# EAGLE schematic Christmas_Star (EAGLE 7.5.0)

## Sheet 1 of 5: 0.8-14V to 5V converter
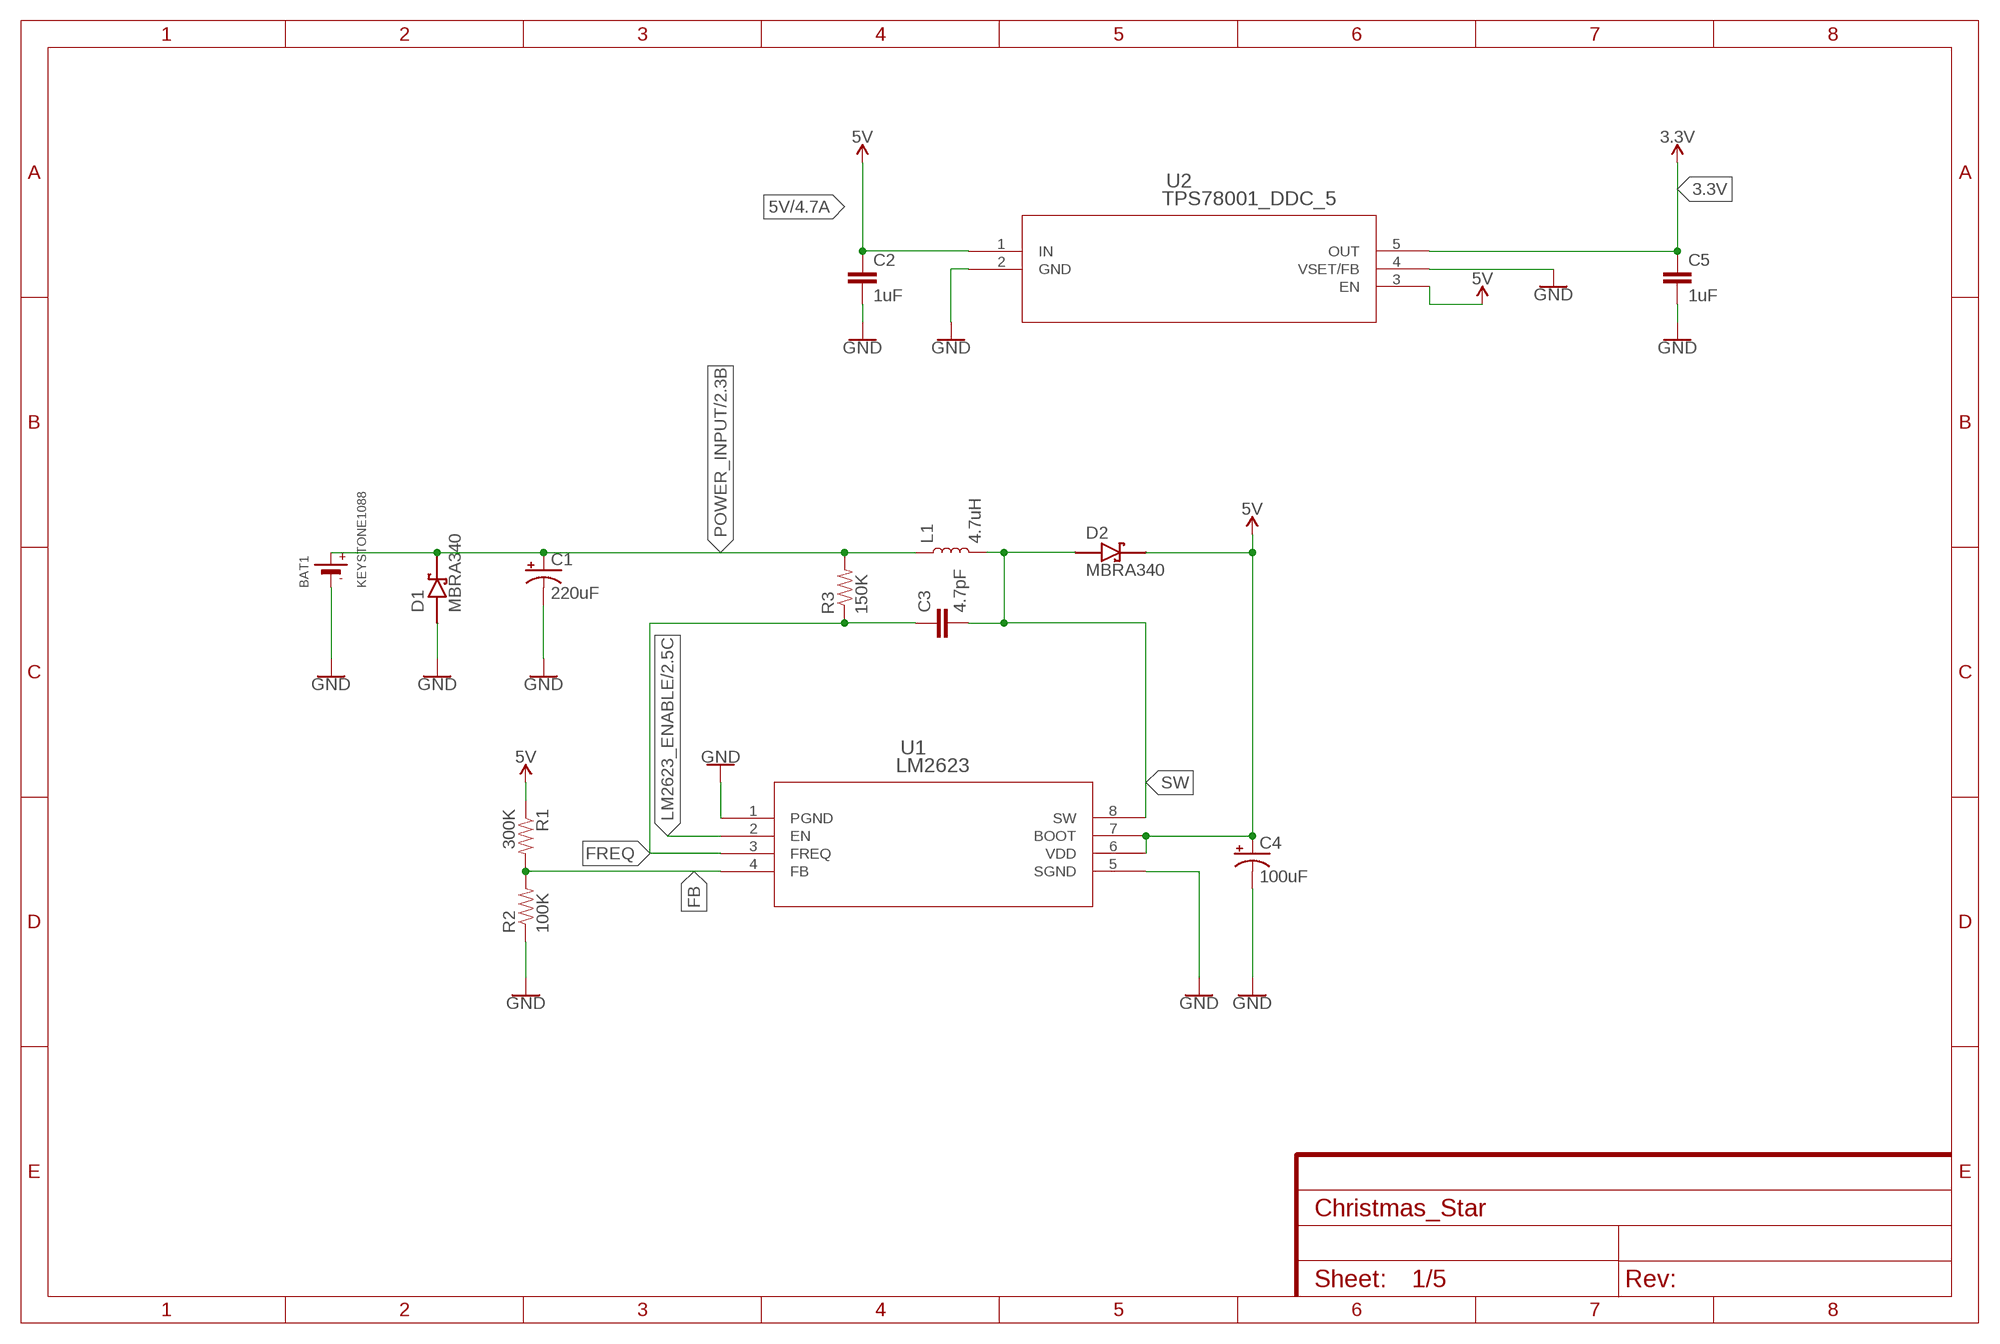
[diagram p0: schematic, sheet 1]
FRAME1 (FRAME-A4L): CNAME: Boost converter (5V), LDO (3.3V); CREVISION: 0.2; DESIGNER: NA'

### Parts
BAT1  KEYSTONE1088  [KEYSTONE1088]
C1  220uF  CAP_POL3528-KIT  [EIA3528-KIT]
C2  1uF  CAP0603-CAP  [0603-CAP]
C3  4.7pF  CAP0603-CAP  [0603-CAP]
C4  100uF  CAP_POL1206-KIT  [EIA3216-KIT]
C5  1uF  CAP0603-CAP  [0603-CAP]
D1  MBRA340  SS12  [DIOM4427X270N]
D2  MBRA340  SS12  [DIOM4427X270N]
L1  4.7uH  INDUCTOR  [LTF5022]
R1  300K  RESISTOR0603-RES  [0603-RES]
R2  100K  RESISTOR0603-RES  [0603-RES]
R3  150K  RESISTOR0603-RES  [0603-RES]
U1  LM2623  LM2623_DGK_8  [MUA08A]
U2  TPS78001_DDC_5  [DDC5]

### Nets
3.3V [3.3V]: C5.1 U2.5(OUT) ; also sheet 5
5V [5V]: C2.1 C4.A(+) D2.C R1.1 U1.6(VDD) U1.7(BOOT) U2.1(IN) U2.3(EN) ; also sheet 3,4,5
FB: R1.2 R2.2 U1.4(FB)
FREQ: C3.1 R3.1 U1.3(FREQ)
GND [GND]: BAT1.- C1.C(-) C2.2 C4.C(-) C5.2 D1.A R2.1 U1.1(PGND) U1.5(SGND) U2.2(GND) U2.4(VSET/FB) ; also sheet 2,3,4,5
LM2623_ENABLE: U1.2(EN) ; also sheet 2
POWER_INPUT [POWER_INPUT]: BAT1.+ C1.A(+) D1.C L1.P$1 R3.2 ; also sheet 2
SW [SW]: C3.2 D2.A L1.P$2 U1.8(SW)

## Sheet 2 of 5: LM2623 Enable Control
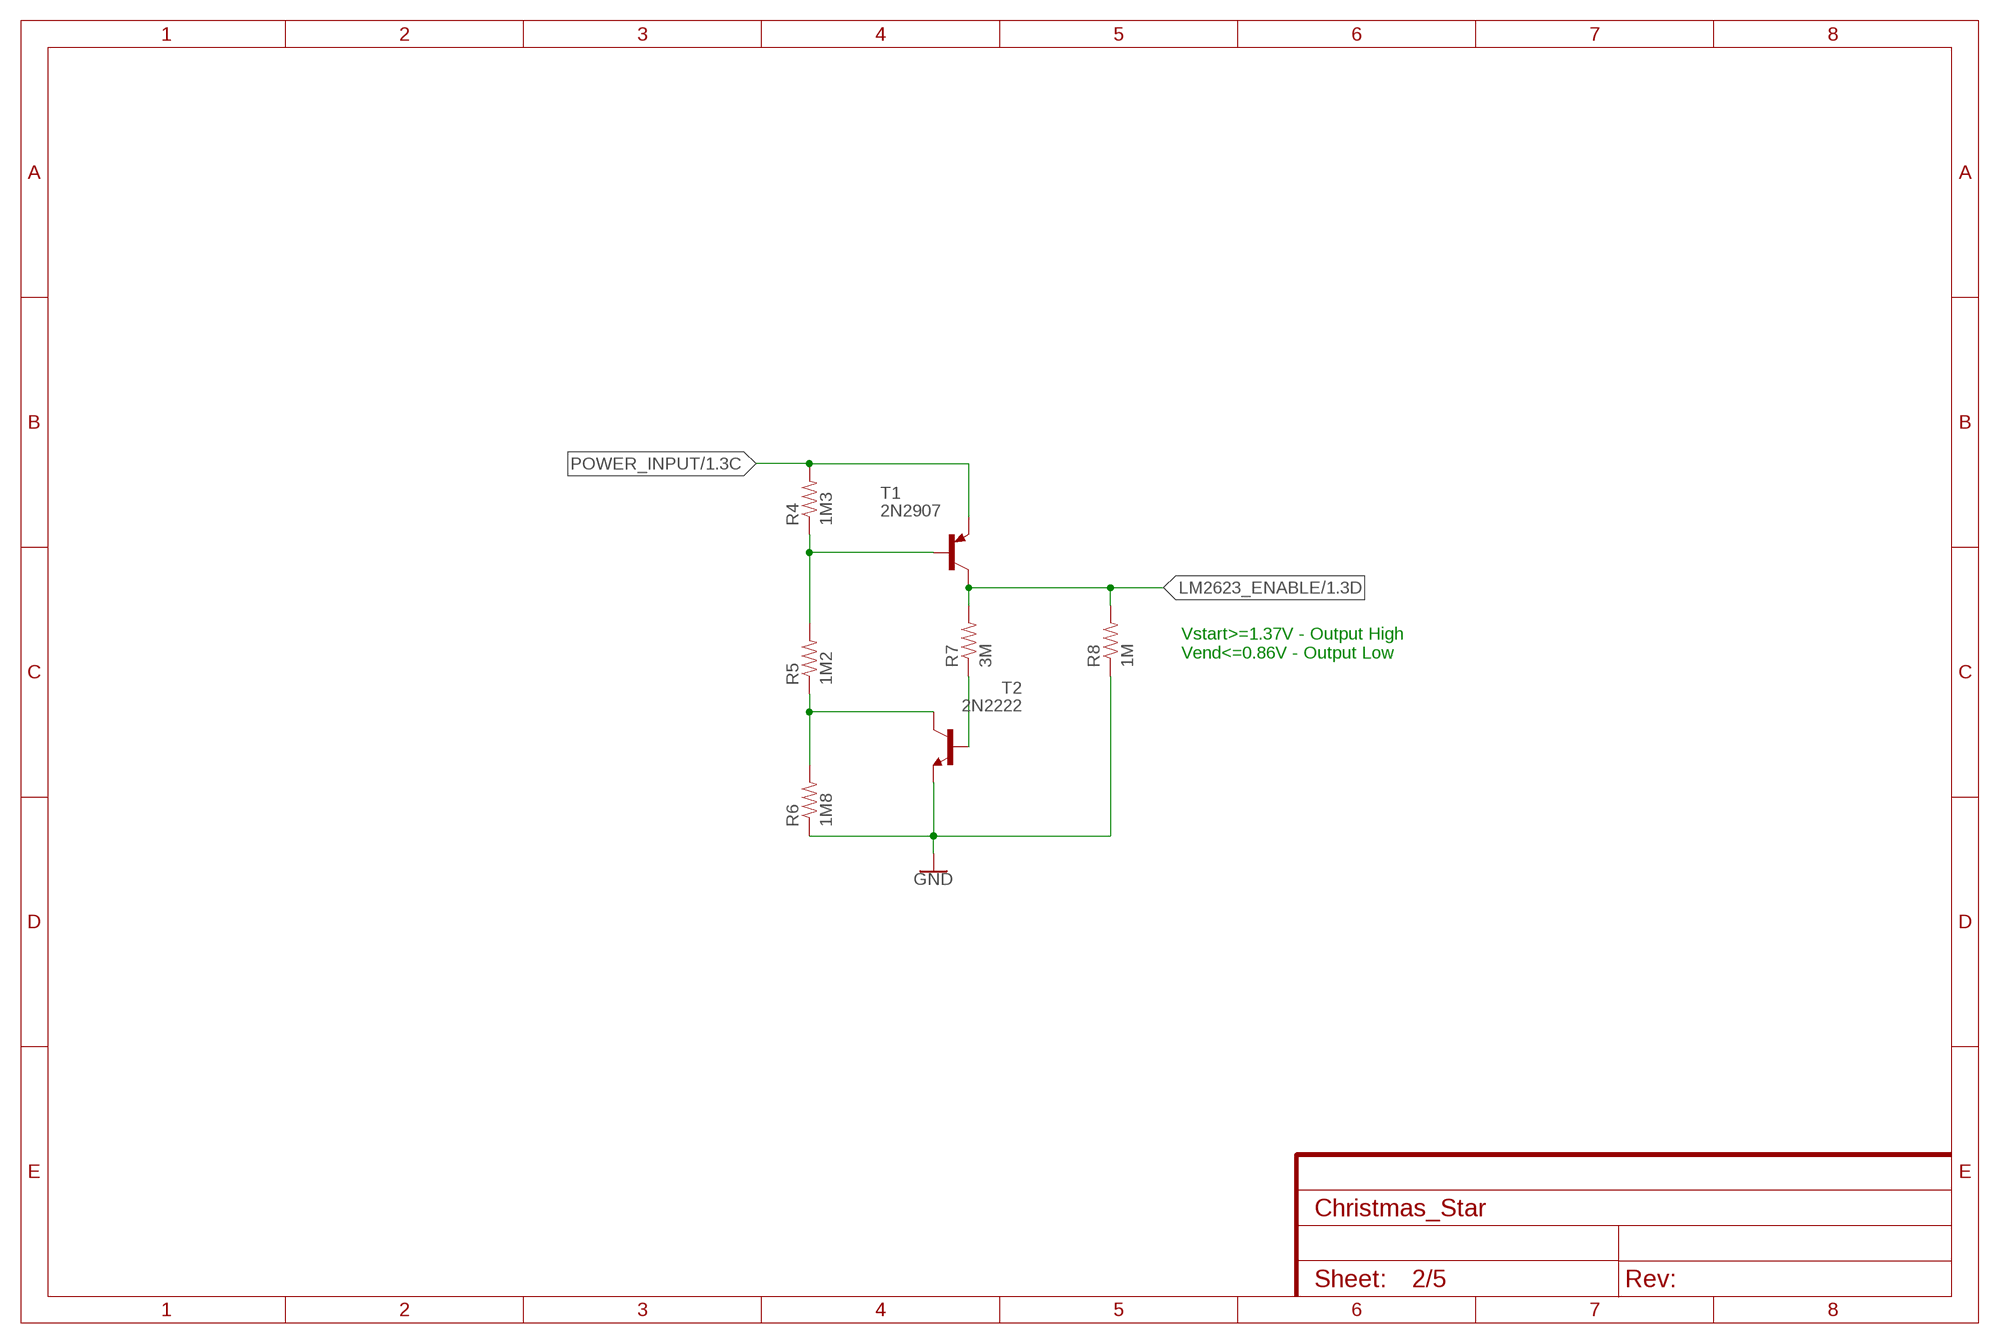
[diagram p1: schematic, sheet 2]
FRAME2 (FRAME-A4L): CNAME: LM2623 EN Pin Control; CREVISION: 0.3; DESIGNER: NA'

### Parts
R4  1M3  RESISTOR0603-RES  [0603-RES]
R5  1M2  RESISTOR0603-RES  [0603-RES]
R6  1M8  RESISTOR0603-RES  [0603-RES]
R7  3M  RESISTOR0603-RES  [0603-RES]
R8  1M  RESISTOR0603-RES  [0603-RES]
T1  2N2907  MMBT2907ALT1-PNP-SOT23-BEC  [SOT23-BEC]
T2  2N2222  MMBT2222ALT1-NPN-SOT23-BEC  [SOT23-BEC]

### Nets
GND [GND]: R6.1 R8.1 T2.E ; also sheet 1,3,4,5
LM2623_ENABLE: R7.2 R8.2 T1.C ; also sheet 1
N$36: R4.1 R5.2 T1.B
N$37: R5.1 R6.2 T2.C
N$43: R7.1 T2.B
POWER_INPUT [POWER_INPUT]: R4.2 T1.E ; also sheet 1

### Notes on the sheet
- Vstart>=1.37V - Output High
  Vend<=0.86V - Output Low

## Sheet 3 of 5: APA102-5050 RGB LED Chain
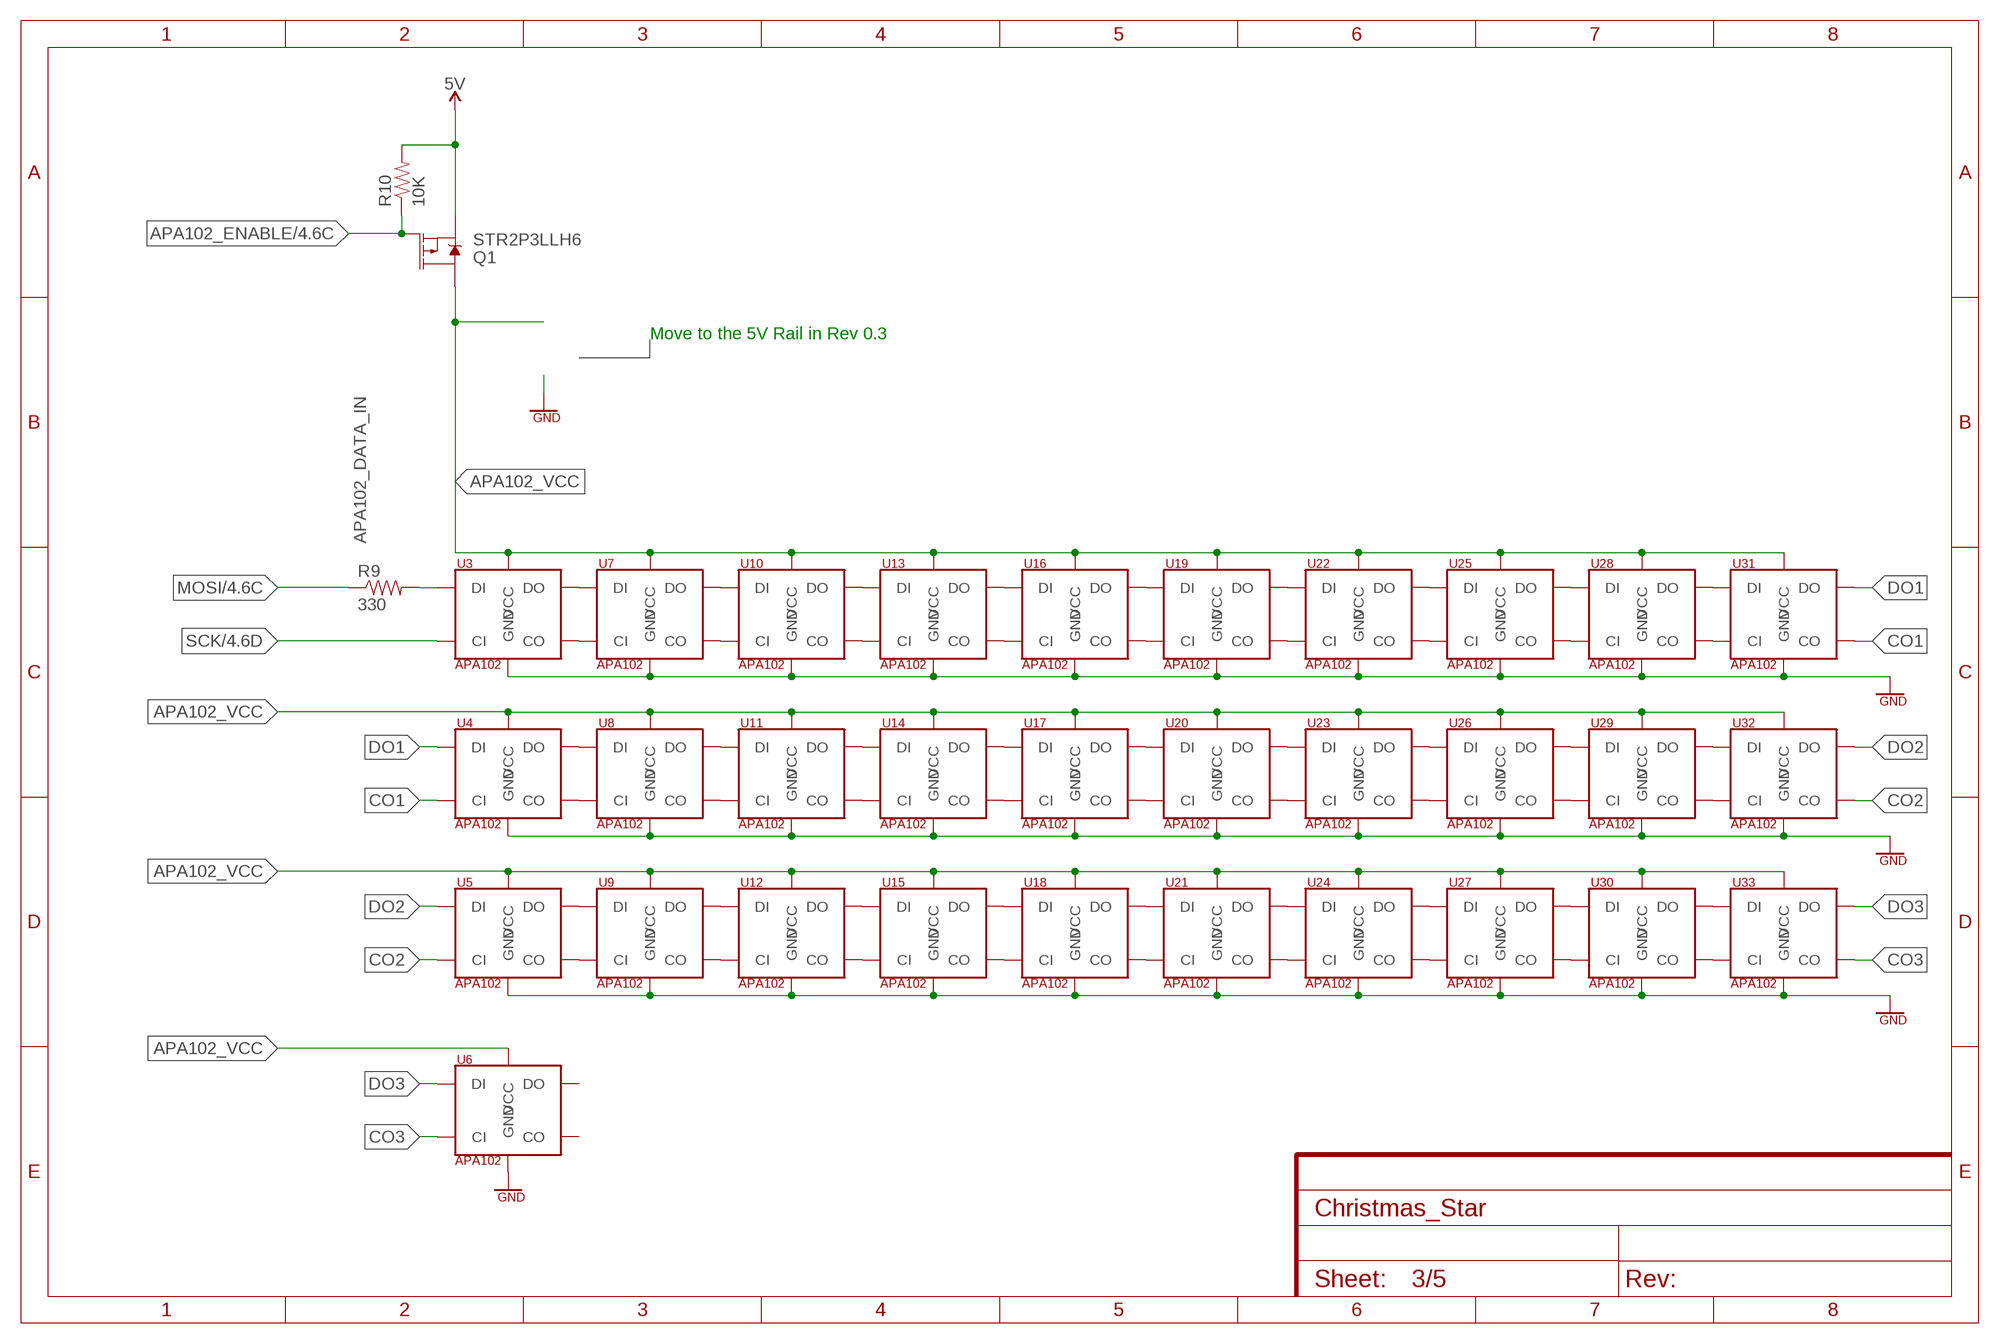
[diagram p2: schematic, sheet 3]
FRAME3 (FRAME-A4L): CNAME: APA102C RGB LEDs; CREVISION: 0.2; DESIGNER: NA'

### Parts
Q1  STR2P3LLH6  MOSFET_PCH-IRLML2244  [SOT23-3]
R9  330  RESISTOR0603-RES  [0603-RES]
R10  10K  RESISTOR0603-RES  [0603-RES]
U3  APA102  APA1022020  [APA102_2020]
U4  APA102  APA1022020  [APA102_2020]
U5  APA102  APA1022020  [APA102_2020]
U6  APA102  APA1022020  [APA102_2020]
U7  APA102  APA1022020  [APA102_2020]
U8  APA102  APA1022020  [APA102_2020]
U9  APA102  APA1022020  [APA102_2020]
U10  APA102  APA1022020  [APA102_2020]
U11  APA102  APA1022020  [APA102_2020]
U12  APA102  APA1022020  [APA102_2020]
U13  APA102  APA1022020  [APA102_2020]
U14  APA102  APA1022020  [APA102_2020]
U15  APA102  APA1022020  [APA102_2020]
U16  APA102  APA1022020  [APA102_2020]
U17  APA102  APA1022020  [APA102_2020]
U18  APA102  APA1022020  [APA102_2020]
U19  APA102  APA1022020  [APA102_2020]
U20  APA102  APA1022020  [APA102_2020]
U21  APA102  APA1022020  [APA102_2020]
U22  APA102  APA1022020  [APA102_2020]
U23  APA102  APA1022020  [APA102_2020]
U24  APA102  APA1022020  [APA102_2020]
U25  APA102  APA1022020  [APA102_2020]
U26  APA102  APA1022020  [APA102_2020]
U27  APA102  APA1022020  [APA102_2020]
U28  APA102  APA1022020  [APA102_2020]
U29  APA102  APA1022020  [APA102_2020]
U30  APA102  APA1022020  [APA102_2020]
U31  APA102  APA1022020  [APA102_2020]
U32  APA102  APA1022020  [APA102_2020]
U33  APA102  APA1022020  [APA102_2020]

### Nets
5V [5V]: Q1.2(S) R10.2 ; also sheet 1,4,5
APA102_DATA_IN: R9.2 U3.D_IN(DI)
APA102_ENABLE: Q1.1(G) R10.1 ; also sheet 4
APA102_VCC [APA102_VCC]: Q1.3(D) U3.VCC U4.VCC U5.VCC U6.VCC U7.VCC U8.VCC U9.VCC U10.VCC U11.VCC U12.VCC U13.VCC U14.VCC U15.VCC U16.VCC U17.VCC U18.VCC U19.VCC U20.VCC U21.VCC U22.VCC U23.VCC U24.VCC U25.VCC U26.VCC U27.VCC U28.VCC U29.VCC U30.VCC U31.VCC U32.VCC U33.VCC
CO1: U4.C_IN(CI) U31.CL_OUT(CO)
CO2: U5.C_IN(CI) U32.CL_OUT(CO)
CO3: U6.C_IN(CI) U33.CL_OUT(CO)
DO1: U4.D_IN(DI) U31.D_OUT(DO)
DO2: U5.D_IN(DI) U32.D_OUT(DO)
DO3: U6.D_IN(DI) U33.D_OUT(DO)
GND [GND]: U3.GND U4.GND U5.GND U6.GND U7.GND U8.GND U9.GND U10.GND U11.GND U12.GND U13.GND U14.GND U15.GND U16.GND U17.GND U18.GND U19.GND U20.GND U21.GND U22.GND U23.GND U24.GND U25.GND U26.GND U27.GND U28.GND U29.GND U30.GND U31.GND U32.GND U33.GND ; also sheet 1,2,4,5
MOSI: R9.1 ; also sheet 4
N$1: U3.D_OUT(DO) U7.D_IN(DI)
N$2: U3.CL_OUT(CO) U7.C_IN(CI)
N$3: U7.D_OUT(DO) U10.D_IN(DI)
N$4: U7.CL_OUT(CO) U10.C_IN(CI)
N$5: U10.D_OUT(DO) U13.D_IN(DI)
N$6: U10.CL_OUT(CO) U13.C_IN(CI)
N$7: U13.D_OUT(DO) U16.D_IN(DI)
N$8: U13.CL_OUT(CO) U16.C_IN(CI)
N$9: U16.D_OUT(DO) U19.D_IN(DI)
N$10: U16.CL_OUT(CO) U19.C_IN(CI)
N$11: U19.D_OUT(DO) U22.D_IN(DI)
N$12: U19.CL_OUT(CO) U22.C_IN(CI)
N$13: U22.D_OUT(DO) U25.D_IN(DI)
N$14: U22.CL_OUT(CO) U25.C_IN(CI)
N$15: U25.D_OUT(DO) U28.D_IN(DI)
N$16: U25.CL_OUT(CO) U28.C_IN(CI)
N$17: U28.D_OUT(DO) U31.D_IN(DI)
N$18: U28.CL_OUT(CO) U31.C_IN(CI)
N$19: U4.D_OUT(DO) U8.D_IN(DI)
N$20: U4.CL_OUT(CO) U8.C_IN(CI)
N$21: U8.D_OUT(DO) U11.D_IN(DI)
N$22: U8.CL_OUT(CO) U11.C_IN(CI)
N$23: U11.D_OUT(DO) U14.D_IN(DI)
N$24: U11.CL_OUT(CO) U14.C_IN(CI)
N$25: U14.D_OUT(DO) U17.D_IN(DI)
N$26: U14.CL_OUT(CO) U17.C_IN(CI)
N$27: U17.D_OUT(DO) U20.D_IN(DI)
N$28: U17.CL_OUT(CO) U20.C_IN(CI)
N$29: U20.D_OUT(DO) U23.D_IN(DI)
N$30: U20.CL_OUT(CO) U23.C_IN(CI)
N$31: U23.D_OUT(DO) U26.D_IN(DI)
N$32: U23.CL_OUT(CO) U26.C_IN(CI)
N$33: U26.D_OUT(DO) U29.D_IN(DI)
N$34: U26.CL_OUT(CO) U29.C_IN(CI)
N$35: U29.D_OUT(DO) U32.D_IN(DI)
N$40: U29.CL_OUT(CO) U32.C_IN(CI)
N$41: U5.D_OUT(DO) U9.D_IN(DI)
N$44: U5.CL_OUT(CO) U9.C_IN(CI)
N$45: U9.D_OUT(DO) U12.D_IN(DI)
N$46: U9.CL_OUT(CO) U12.C_IN(CI)
N$48: U12.D_OUT(DO) U15.D_IN(DI)
N$49: U12.CL_OUT(CO) U15.C_IN(CI)
N$50: U15.D_OUT(DO) U18.D_IN(DI)
N$51: U15.CL_OUT(CO) U18.C_IN(CI)
N$52: U18.D_OUT(DO) U21.D_IN(DI)
N$53: U18.CL_OUT(CO) U21.C_IN(CI)
N$55: U21.D_OUT(DO) U24.D_IN(DI)
N$56: U21.CL_OUT(CO) U24.C_IN(CI)
N$58: U24.D_OUT(DO) U27.D_IN(DI)
N$60: U24.CL_OUT(CO) U27.C_IN(CI)
N$61: U27.D_OUT(DO) U30.D_IN(DI)
N$62: U27.CL_OUT(CO) U30.C_IN(CI)
N$63: U30.D_OUT(DO) U33.D_IN(DI)
N$64: U30.CL_OUT(CO) U33.C_IN(CI)
SCK: U3.C_IN(CI) ; also sheet 4
Unconnected: U6.CL_OUT(CO) U6.D_OUT(DO)

### Notes on the sheet
- Move to the 5V Rail in Rev 0.3

## Sheet 4 of 5: ATMEGA328P-U
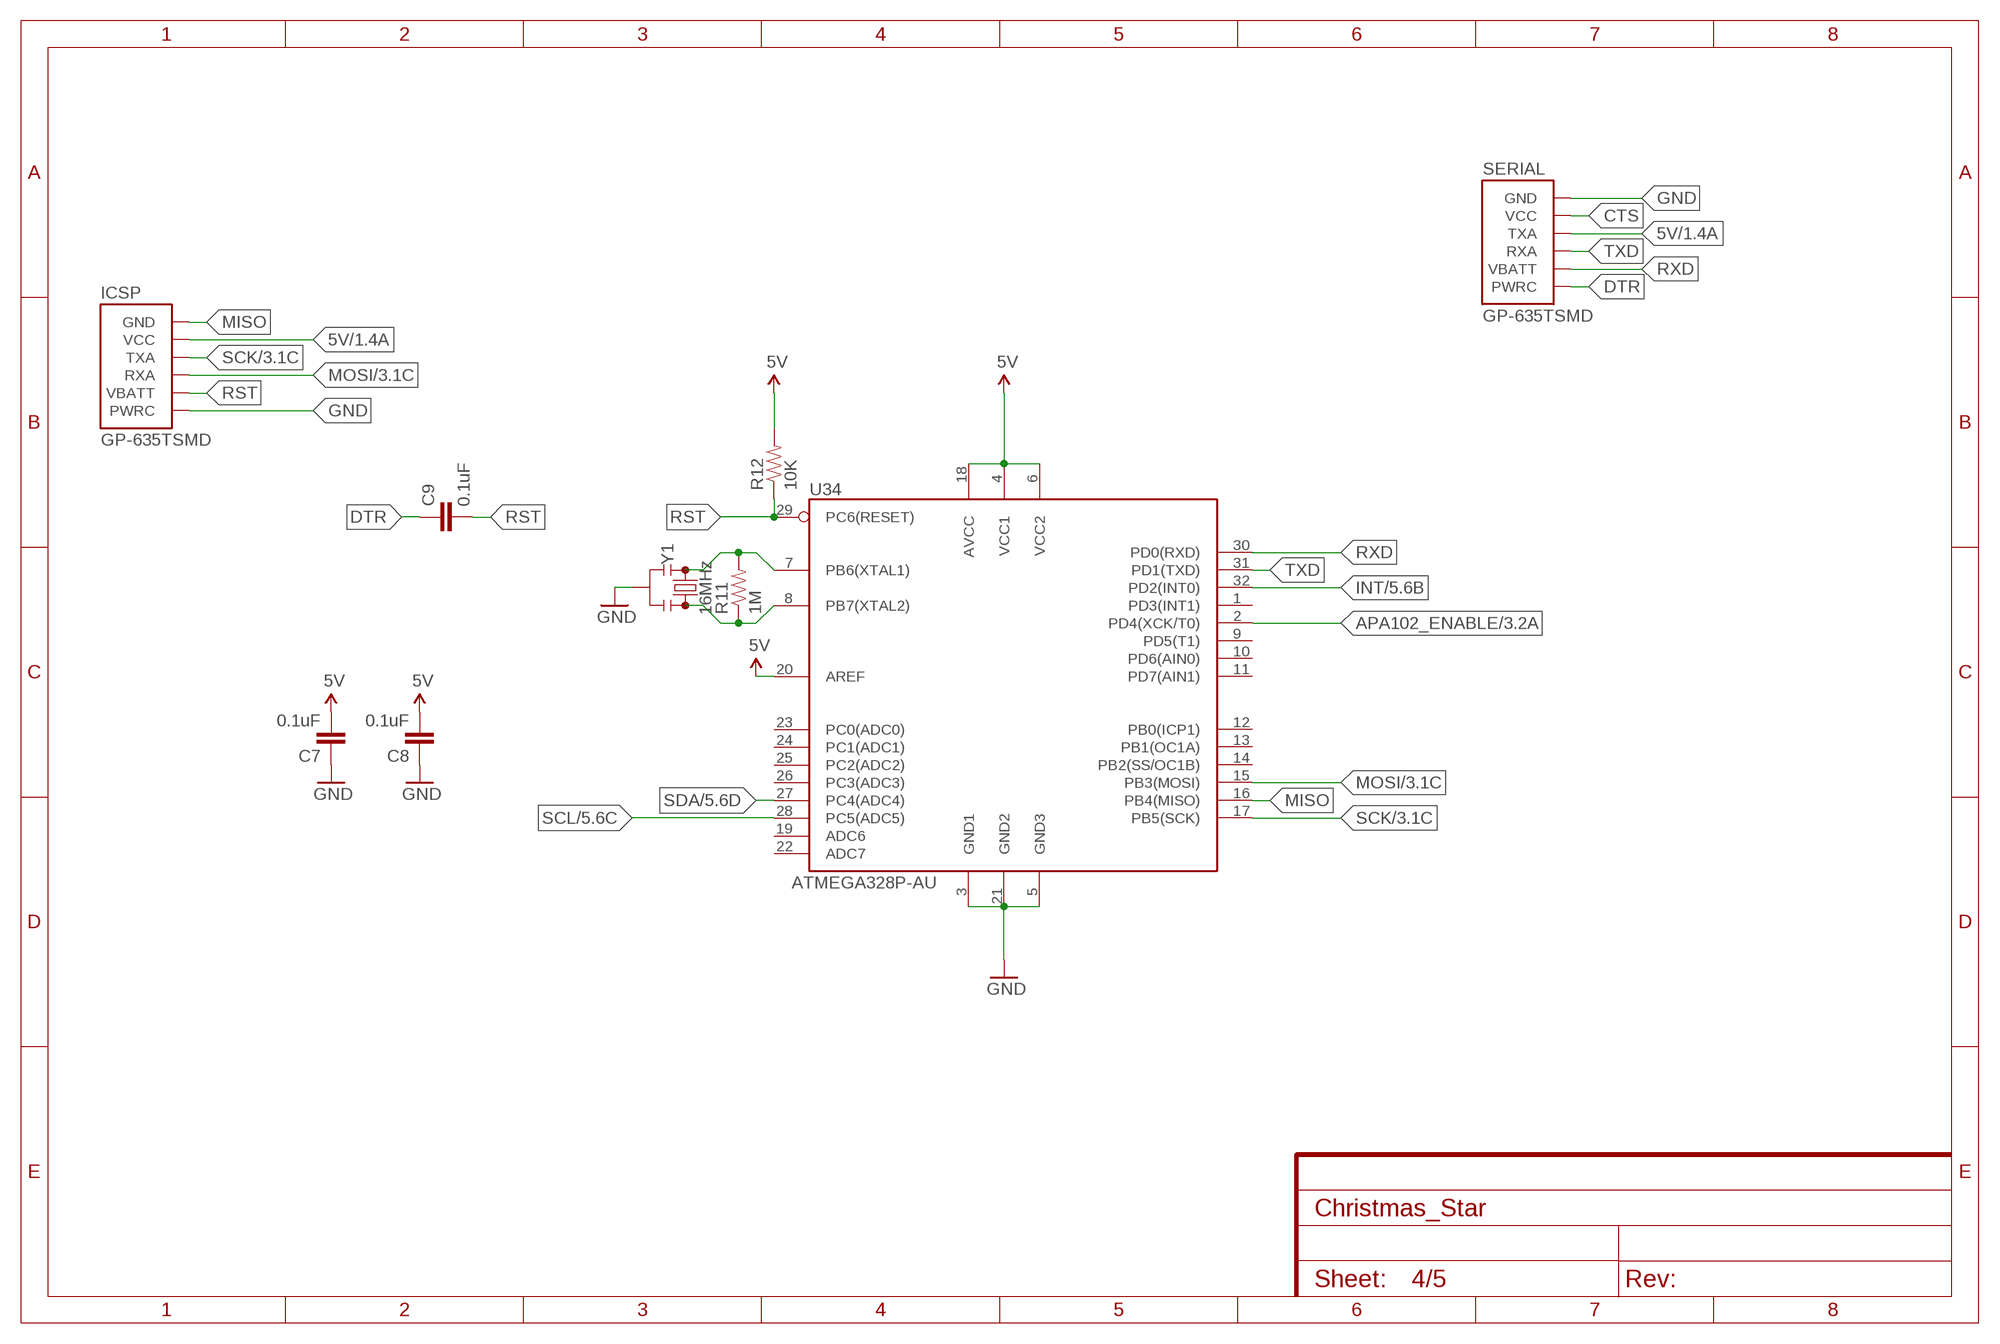
[diagram p3: schematic, sheet 4]
FRAME4 (FRAME-A4L): CNAME: ATMEGA328P-U; CREVISION: 0.2; DESIGNER: NA'

### Parts
C7  0.1uF  CAP0603-CAP  [0603-CAP]
C8  0.1uF  CAP0603-CAP  [0603-CAP]
C9  0.1uF  CAP0603-CAP  [0603-CAP]
ICSP  GP-635TSMD  [GP-635T]
R11  1M  RESISTOR0603-RES  [0603-RES]
R12  10K  RESISTOR0603-RES  [0603-RES]
SERIAL  GP-635TSMD  [GP-635T]
U34  ATMEGA328P-AU  [TQFP32]
Y1  16MHz  RESONATOR-16MHZSMD_3.2X1.3  [RESONATOR-SMD-3.2X1.3]

### Nets
5V [5V]: C7.2 C8.2 ICSP.2(VCC) R12.2 SERIAL.3(TXA) U34.4(VCC1) U34.6(VCC2) U34.18(AVCC) U34.20(AREF) ; also sheet 1,3,5
APA102_ENABLE: U34.2(PD4(XCK/T0)) ; also sheet 3
CTS: SERIAL.2(VCC)
DTR: C9.1 SERIAL.6(PWRC)
GND [GND]: C7.1 C8.1 ICSP.6(PWRC) SERIAL.1(GND) U34.3(GND1) U34.5(GND3) U34.21(GND2) Y1.2 ; also sheet 1,2,3,5
INT: U34.32(PD2(INT0)) ; also sheet 5
MISO: ICSP.1(GND) U34.16(PB4(MISO))
MOSI: ICSP.4(RXA) U34.15(PB3(MOSI)) ; also sheet 3
N$38: R11.2 U34.7(PB6(XTAL1)) Y1.1
N$39: R11.1 U34.8(PB7(XTAL2)) Y1.3
RST: C9.2 ICSP.5(VBATT) R12.1 U34.29(PC6(RESET))
RXD: SERIAL.5(VBATT) U34.30(PD0(RXD))
SCK: ICSP.3(TXA) U34.17(PB5(SCK)) ; also sheet 3
SCL: U34.28(PC5(ADC5)) ; also sheet 5
SDA: U34.27(PC4(ADC4)) ; also sheet 5
TXD: SERIAL.4(RXA) U34.31(PD1(TXD))
Unconnected: U34.1(PD3(INT1)) U34.9(PD5(T1)) U34.10(PD6(AIN0)) U34.11(PD7(AIN1)) U34.12(PB0(ICP1)) U34.13(PB1(OC1A)) U34.14(PB2(SS/OC1B)) U34.19(ADC6) U34.22(ADC7) U34.23(PC0(ADC0)) U34.24(PC1(ADC1)) U34.25(PC2(ADC2)) U34.26(PC3(ADC3))

## Sheet 5 of 5
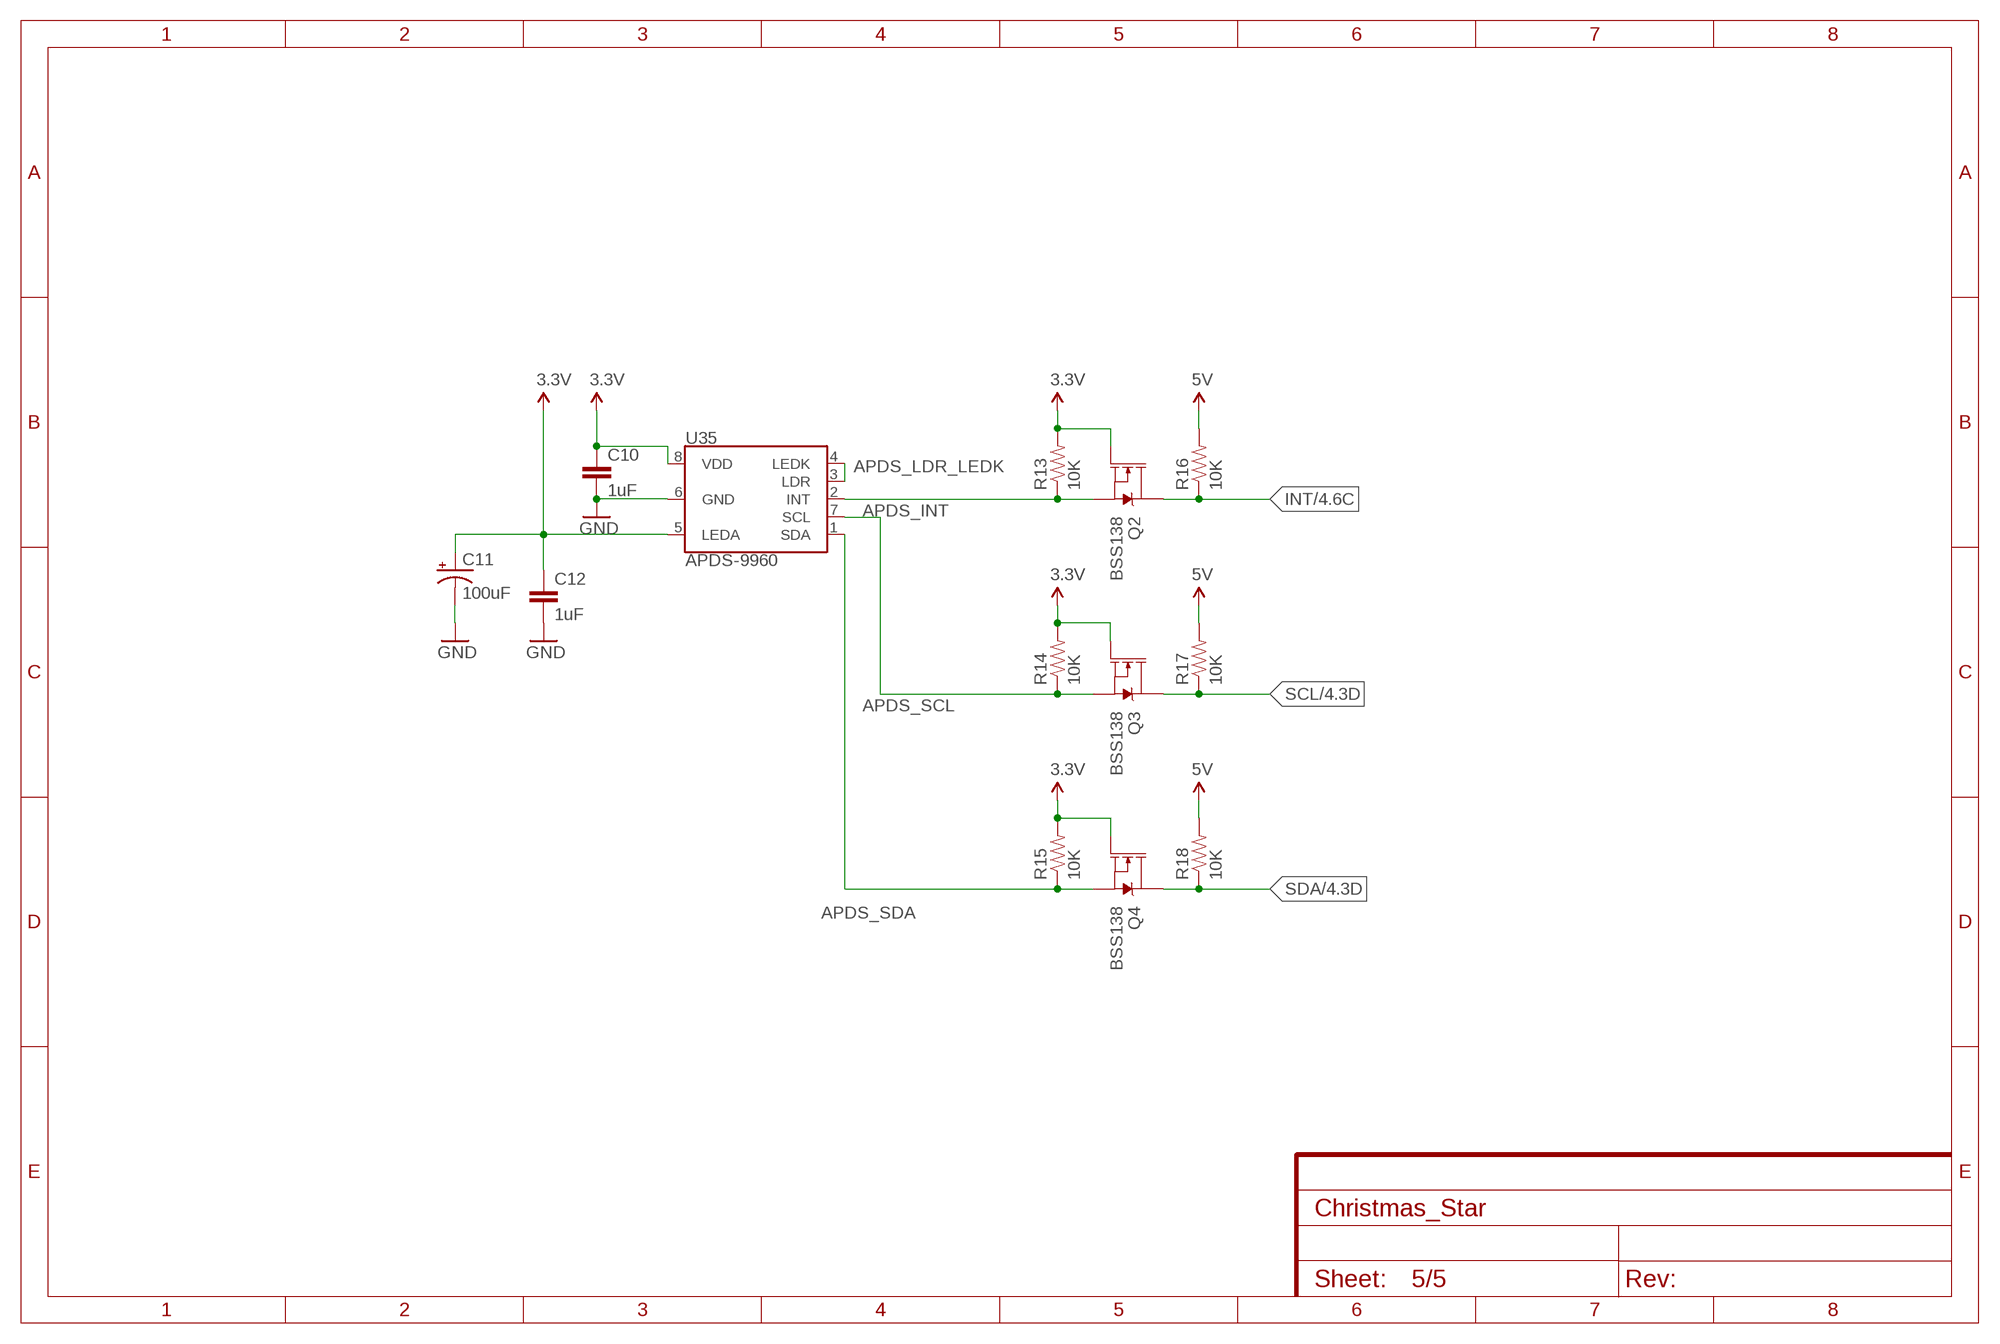
[diagram p4: schematic, sheet 5]
FRAME5 (FRAME-A4L): CNAME: APDS9960 & I2C Level Shifters; CREVISION: 0.2; DESIGNER: NA'

### Parts
C10  1uF  CAP0603-CAP  [0603-CAP]
C11  100uF  CAP_POL1206-KIT  [EIA3216-KIT]
C12  1uF  CAP0603-CAP  [0603-CAP]
Q2  BSS138  MOSFET-NCH-BSS138  [SOT23-3]
Q3  BSS138  MOSFET-NCH-BSS138  [SOT23-3]
Q4  BSS138  MOSFET-NCH-BSS138  [SOT23-3]
R13  10K  RESISTOR0603-RES  [0603-RES]
R14  10K  RESISTOR0603-RES  [0603-RES]
R15  10K  RESISTOR0603-RES  [0603-RES]
R16  10K  RESISTOR0603-RES  [0603-RES]
R17  10K  RESISTOR0603-RES  [0603-RES]
R18  10K  RESISTOR0603-RES  [0603-RES]
U35  APDS-9960  [APDS-9960]

### Nets
3.3V [3.3V]: C10.1 C11.A(+) C12.1 Q2.1(G) Q3.1(G) Q4.1(G) R13.2 R14.2 R15.2 U35.5(LEDA) U35.8(VDD) ; also sheet 1
5V [5V]: R16.2 R17.2 R18.2 ; also sheet 1,3,4
APDS_INT: Q2.2(S) R13.1 U35.2(INT)
APDS_LDR_LEDK: U35.3(LDR) U35.4(LEDK)
APDS_SCL: Q3.2(S) R14.1 U35.7(SCL)
APDS_SDA: Q4.2(S) R15.1 U35.1(SDA)
GND [GND]: C10.2 C11.C(-) C12.2 U35.6(GND) ; also sheet 1,2,3,4
INT: Q2.3(D) R16.1 ; also sheet 4
SCL: Q3.3(D) R17.1 ; also sheet 4
SDA: Q4.3(D) R18.1 ; also sheet 4

## Library data of the parts
BAT1 = keystone:KEYSTONE1088
C1 C4 = SparkFun-Passives:CAP_POL: Capacitor Polarized These are standard SMD and PTH capacitors. Normally 10uF, 47uF, and 100uF in electrolytic and tantalum varieties. Always verify the external diameter of the through hole cap, it varies with capacity, voltage, and manufacturer. The EIA devices should be standard.
C2 C5 C7-C10 C12 = SparkFun-Passives:CAP: Capacitor Standard 0603 ceramic capacitor, and 0.1" leaded capacitor.
C3 = SparkFun-Capacitors:CAP: Capacitor Standard 0603 ceramic capacitor, and 0.1" leaded capacitor.
C11 = SparkFun-Capacitors:CAP_POL: Capacitor Polarized These are standard SMD and PTH capacitors. Normally 10uF, 47uF, and 100uF in electrolytic and tantalum varieties. Always verify the external diameter of the through hole cap, it varies with capacity, voltage, and manufacturer. The EIA devices should be standard.
D1 D2 = Common-Parts-Library-Eagle:SS12: SS12 Series 500 mV 1 A 20 V Max Reverse Voltage Schottky Rectifier - DO-214AC; MANUFACTURER: Fairchild Semiconductor
ICSP SERIAL = SparkFun-Sensors:GP-635T: Footprint and symbol for a generic 6-pin JST GPS module connector.; PROD_ID: CONN-08249
L1 = LTF5022_Inductor:INDUCTOR: LTF5022 Footprint
Q1 = SparkFun-DiscreteSemi:MOSFET_PCH: P-channel MOSFETs Voltage controlled devices that allow control of high current outputs. SparkFun Products: SparkFun ESP32 Thing <https://www.sparkfun.com/products/13907> SparkFun ESP8266 Thing <https://www.sparkfun.com/products/13231>; PROD_ID: TRANS-11153; VALUE: 4.3A/20V/54mΩ
Q2-Q4 = SparkFun-DiscreteSemi:MOSFET-NCH: N-channel MOSFETs Voltage controlled devices that allow control of high current outputs. SparkFun Products: SparkFun OpenScale <https://www.sparkfun.com/products/13261> SparkFun Digital Sandbox <https://www.sparkfun.com/products/12651> SparkFun Monster Moto Shield <https://www.sparkfun.com/products/10182> SparkFun MOSFET Power Controller <https://www.sparkfun.com/products/11214>; PROD_ID: TRANS-00830; VALUE: 220mA/50V/3.5Ω
R1-R18 = SparkFun-Passives:RESISTOR: Resistor Basic schematic elements and footprints for 0603, 1206, and PTH resistors.
T1 = transistor:*-PNP-: PNP Transistror
T2 = transistor:*-NPN-: NPN Transistror BF959 corrected 2008.03.06
U1 = lm2623:LM2623_DGK_8; MANUFACTURER_PART_NUMBER: lm2623ammnopb; VENDOR: National
U2 = TPS780:TPS78001_DDC_5; DATASHEETURL: httpwww.ti.comlitgpnTPS78001; FAMILY_NAME: SINGLE CHANNEL LDO; GENERIC_PART_NUMBER: TPS78001; INDUSTRY_STD_PKG_TYPE: SOT; MANUFACTURER: Texas Instruments; MANUFACTURER_PART_NUMBER: tps78001_ddc_5; PACKAGE_DESIGNATOR: DDC; PIN_COUNT: 5; VENDOR: Texas Instruments
U3-U33 = jos-ph:APA102: APA102C 5050 RGB LED -- Adafruit DotStar Single LED Pixel Product Page: https://www.adafruit.com/products/2343 Datasheet: https://cdn-shop.adafruit.com/product-files/2343/APA102C.pdf
U34 = eagle-book:ATMEGA328P: Atmel 32-pin 8-bit microcontroller
U35 = SparkFun-Sensors:APDS-9960: Avago APDS-9960 Digital Proximity, Ambient Light, RGB, and Gesture Sensor. The APDS-9960 offers ambient light and color measuring, proximity detection, and touchless gesture sensing. It features UV and IR blocking filters, four separate diodes sensitive to different directions, and an I2C compatible interface. Datasheet <https://cdn.sparkfun.com/datasheets/Sensors/Proximity/apds9960.pdf> SparkFun Products SparkFun RGB and Gesture Sensor - APDS-9960 <https://www.sparkfun.com/products/12787> (SEN-12787); PROD_ID: SEN-12005
Y1 = SparkFun-Clocks:RESONATOR-16MHZ: 16MHz Resonator Digikey Example <http://www.digikey.com/product-detail/en/murata-electronics-north-america/CSTCE16M0V53-R0/490-1198-1-ND/584635> Frequency: 16MHz Frequency Stability: ±0.3% Frequency Tolerance: ±0.5% Capacitance: 15pF SparkFun Products SparkFun OpenLog <https://www.sparkfun.com/products/13712> SparkFun MicroView - OLED Arduino Module <https://www.sparkfun.com/products/12923>; PROD_ID: XTAL-08900

## Net classes
0 default: width 0.203 mm
1 5V: width 0.508 mm
2 3.3V: width 0.254 mm
3 GND: width 0.508 mm
4 APA102_VCC: width 0.508 mm
5 POWER_INPUT: width 0.762 mm
6 SW: width 0.508 mm